# EAGLE schematic sensors1 (EAGLE 8.4.0)
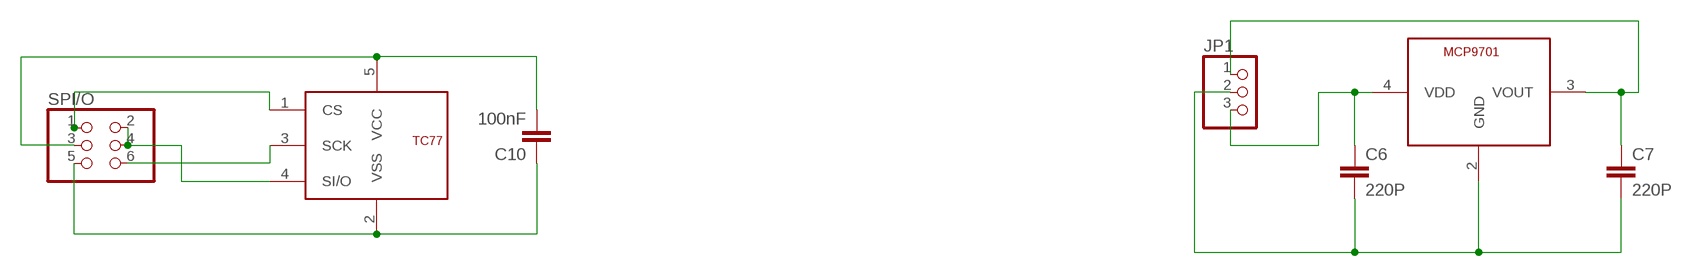
[diagram p0: schematic, sheet 1]

## Parts
C6  220P  C-EUC0805  [C0805]
C7  220P  C-EUC0805  [C0805]
C10  100nF  C-EUC0805K  [C0805K]
JP1  PINHD-1X3  [1X03]
SPI/O  PINHD-2X3  [2X03]
U$1  MCP9701  [SC70-5L]
U$5  TC77-3.3MCTTR  [SOT23-5]

## Nets
N$13: C7.1 JP1.1 U$1.3(VOUT)
N$14: C6.2 C7.2 JP1.2 U$1.2(GND)
N$15: C6.1 JP1.3 U$1.4(VDD)
N$19: C10.2 SPI/O.3 U$5.5(VCC)
N$20: C10.1 SPI/O.5 U$5.2(VSS)
N$21: SPI/O.1 U$5.1(CS)
N$23: SPI/O.2 SPI/O.4 U$5.4(SI/O)
N$25: SPI/O.6 U$5.3(SCK)

## Library data of the parts
C6 C7 C10 = resistor:C-EU: CAPACITOR, European symbol
JP1 = pinhead:PINHD-1X3: PIN HEADER
SPI/O = pinhead:PINHD-2X3: PIN HEADER
U$1 = MCP9701T:MCP9701
U$5 = TC77-3.3mcttr:TC77-3.3MCTTR